# Altium schematic sheet MIXR Processing - STM32 DSP Microcontroller.SchDoc: STM32F767 DSP Microcontroller - GPIOs
size B; DocumentNumber: 9; SheetNumber: 9; SheetTotal: 14
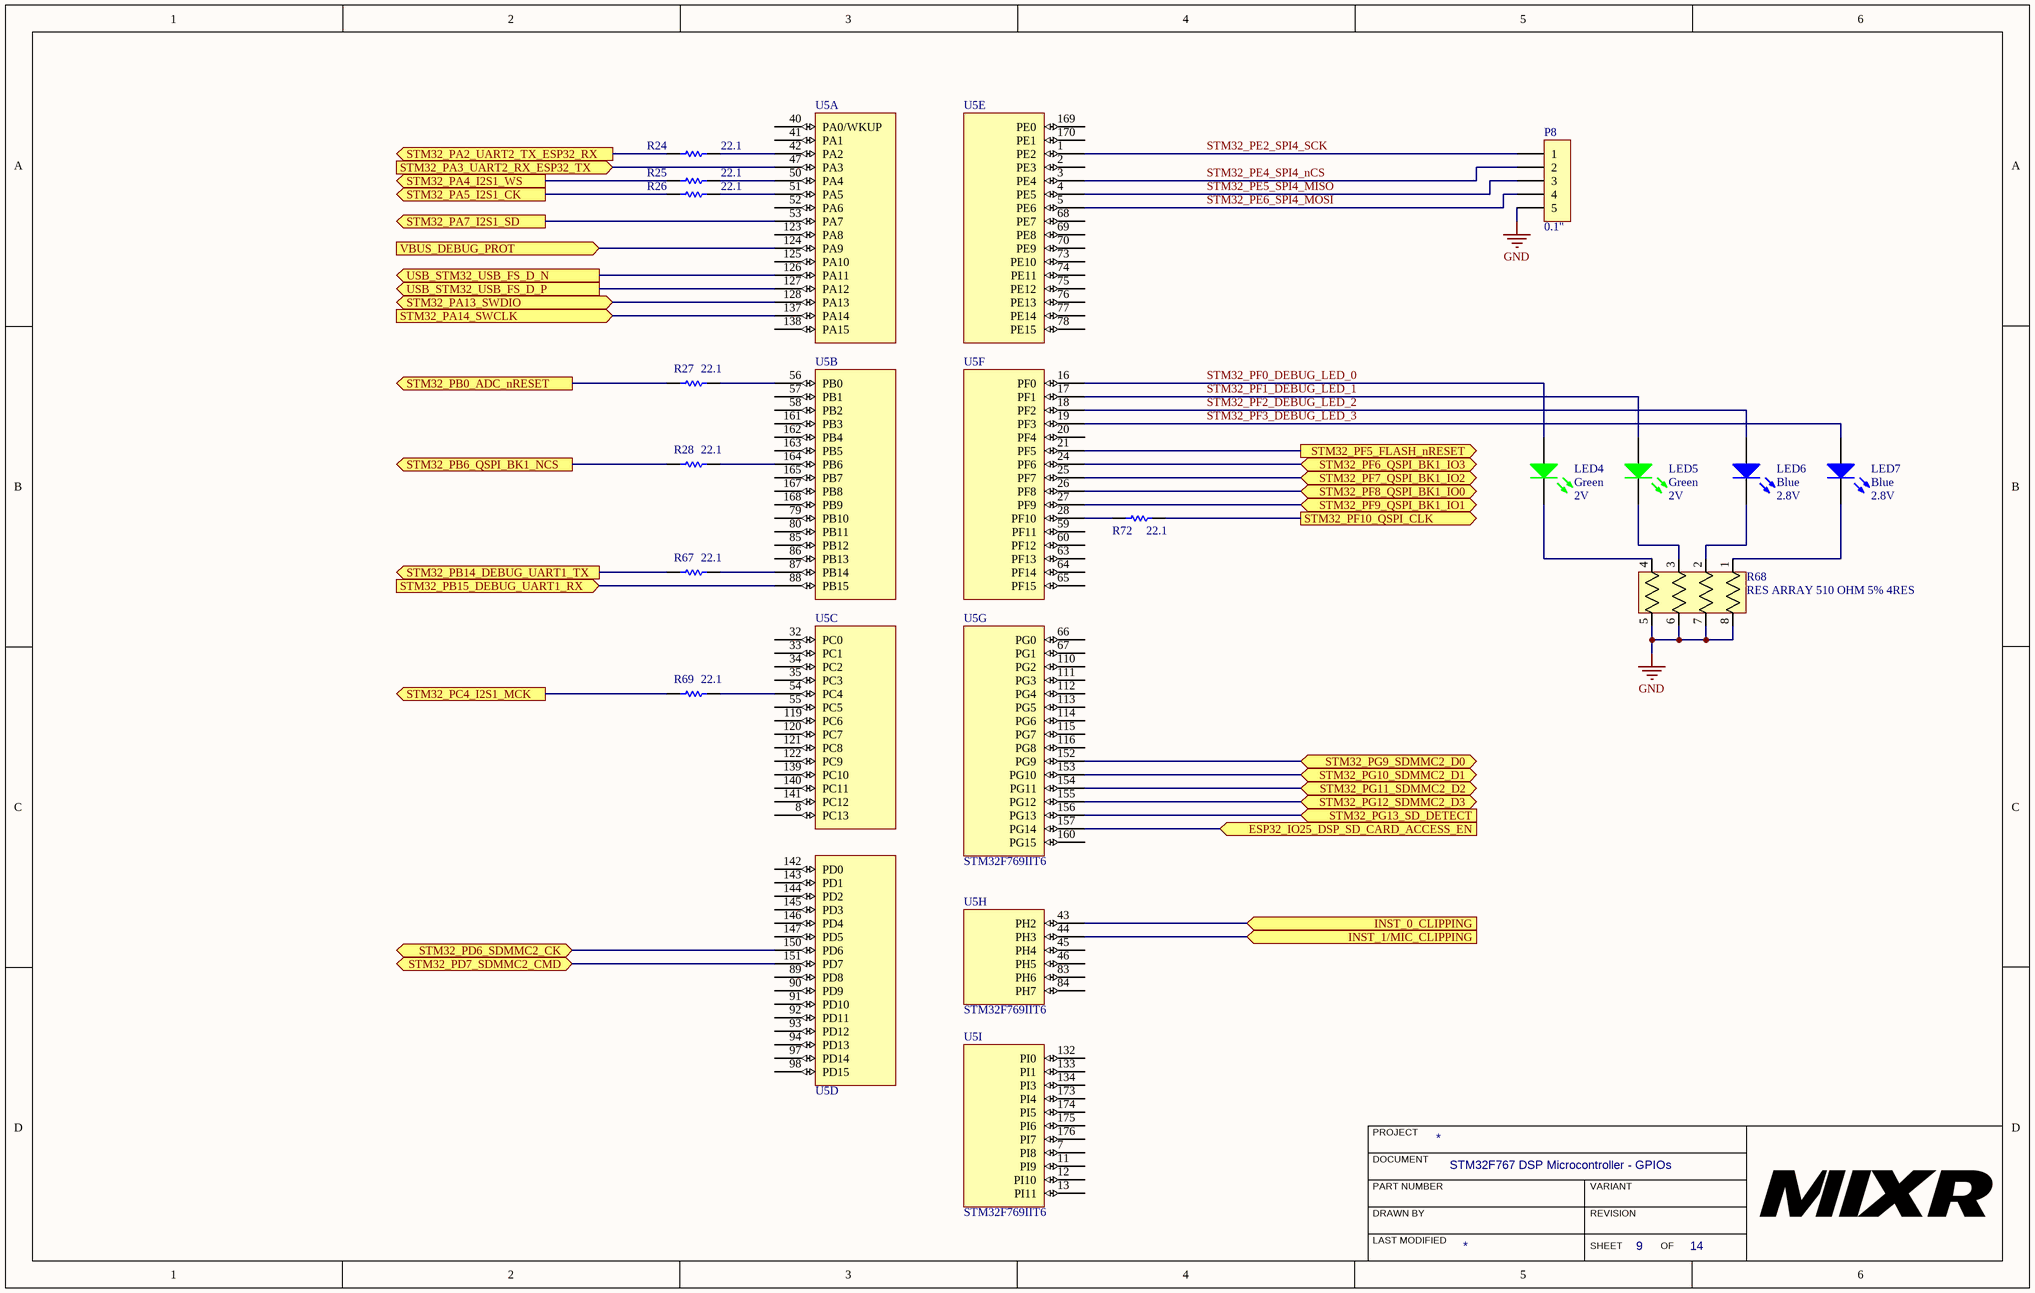
[diagram p0: MIXR Processing - STM32 DSP Microcontroller.SchDoc]

## Parts
LED4  Color: Green  Voltage - Forward (Vf) (Typ): 2V  [LED_0603]  (hidden comment: LED GREEN CLEAR 2V 0603)
LED5  Color: Green  Voltage - Forward (Vf) (Typ): 2V  [LED_0603]  (hidden comment: LED GREEN CLEAR 2V 0603)
LED6  Color: Blue  Voltage - Forward (Vf) (Typ): 2.8V  [LED_0603]  (hidden comment: LED BLUE CLEAR 2.8V 0603)
LED7  Color: Blue  Voltage - Forward (Vf) (Typ): 2.8V  [LED_0603]  (hidden comment: LED BLUE CLEAR 2.8V 0603)
P8  0.1"  [CONN, 5POS 1.23" 0.100" MALE Header]
R24  Resistance: 22.1  [RES, 0603]  (hidden comment: RES 22.1 OHM 1% 1/10W 0603)
R25  Resistance: 22.1  [RES, 0603]  (hidden comment: RES 22.1 OHM 1% 1/10W 0603)
R26  Resistance: 22.1  [RES, 0603]  (hidden comment: RES 22.1 OHM 1% 1/10W 0603)
R27  Resistance: 22.1  [RES, 0603]  (hidden comment: RES 22.1 OHM 1% 1/10W 0603)
R28  Resistance: 22.1  [RES, 0603]  (hidden comment: RES 22.1 OHM 1% 1/10W 0603)
R67  Resistance: 22.1  [RES, 0603]  (hidden comment: RES 22.1 OHM 1% 1/10W 0603)
R68  RES ARRAY 510 OHM 5% 4RES  [RES ARRAY 4 POS 0804]
R69  Resistance: 22.1  [RES, 0603]  (hidden comment: RES 22.1 OHM 1% 1/10W 0603)
R72  Resistance: 22.1  [RES, 0603]  (hidden comment: RES 22.1 OHM 1% 1/10W 0603)
U5  IC MCU STM32F769II 176-LQFP  [TSQFP50P2600X2600X160-176M]  (value not drawn)  (parts A,B,C,D,E,F,G,H,I of 11)

## Ports
ESP32_IO25_DSP_SD_CARD_ACCESS_EN (in), INST_0_CLIPPING (in), INST_1/MIC_CLIPPING (in), STM32_PA2_UART2_TX_ESP32_RX (out), STM32_PA3_UART2_RX_ESP32_TX (in), STM32_PA4_I2S1_WS (out), STM32_PA5_I2S1_CK (out), STM32_PA7_I2S1_SD (out), STM32_PA13_SWDIO (bidir), STM32_PA14_SWCLK (in), STM32_PB0_ADC_nRESET (out), STM32_PB6_QSPI_BK1_NCS (out), STM32_PB14_DEBUG_UART1_TX (out), STM32_PB15_DEBUG_UART1_RX (in), STM32_PC4_I2S1_MCK (out), STM32_PD6_SDMMC2_CK (bidir), STM32_PD7_SDMMC2_CMD (bidir), STM32_PF5_FLASH_nRESET (out), STM32_PF6_QSPI_BK1_IO3 (bidir), STM32_PF7_QSPI_BK1_IO2 (bidir), STM32_PF8_QSPI_BK1_IO0 (bidir), STM32_PF9_QSPI_BK1_IO1 (bidir), STM32_PF10_QSPI_CLK (out), STM32_PG9_SDMMC2_D0 (bidir), STM32_PG10_SDMMC2_D1 (bidir), STM32_PG11_SDMMC2_D2 (bidir), STM32_PG12_SDMMC2_D3 (bidir), STM32_PG13_SD_DETECT (in), USB_STM32_USB_FS_D_N (out), USB_STM32_USB_FS_D_P (out), VBUS_DEBUG_PROT (in)

## Nets
GND: P8.5 R68.5 R68.6 R68.7 R68.8
ESP32_IO25_DSP_SD_CARD_ACCESS_EN: U5.157(PG14) ; port ESP32_IO25_DSP_SD_CARD_ACCESS_EN
INST_0_CLIPPING: U5.43(PH2) ; port INST_0_CLIPPING
INST_1/MIC_CLIPPING: U5.44(PH3) ; port INST_1/MIC_CLIPPING
STM32_PA2_UART2_TX_ESP32_RX: R24.1 ; port STM32_PA2_UART2_TX_ESP32_RX
STM32_PA3_UART2_RX_ESP32_TX: U5.47(PA3) ; port STM32_PA3_UART2_RX_ESP32_TX
STM32_PA4_I2S1_WS: R25.1 ; port STM32_PA4_I2S1_WS
STM32_PA5_I2S1_CK: R26.1 ; port STM32_PA5_I2S1_CK
STM32_PA7_I2S1_SD: U5.53(PA7) ; port STM32_PA7_I2S1_SD
STM32_PA13_SWDIO: U5.128(PA13) ; port STM32_PA13_SWDIO
STM32_PA14_SWCLK: U5.137(PA14) ; port STM32_PA14_SWCLK
STM32_PB0_ADC_nRESET: R27.1 ; port STM32_PB0_ADC_nRESET
STM32_PB6_QSPI_BK1_NCS: R28.1 ; port STM32_PB6_QSPI_BK1_NCS
STM32_PB14_DEBUG_UART1_TX: R67.1 ; port STM32_PB14_DEBUG_UART1_TX
STM32_PB15_DEBUG_UART1_RX: U5.88(PB15) ; port STM32_PB15_DEBUG_UART1_RX
STM32_PC4_I2S1_MCK: R69.1 ; port STM32_PC4_I2S1_MCK
STM32_PD6_SDMMC2_CK: U5.150(PD6) ; port STM32_PD6_SDMMC2_CK
STM32_PD7_SDMMC2_CMD: U5.151(PD7) ; port STM32_PD7_SDMMC2_CMD
STM32_PE2_SPI4_SCK: P8.1 U5.1(PE2)
STM32_PE4_SPI4_nCS: P8.2 U5.3(PE4)
STM32_PE5_SPI4_MISO: P8.3 U5.4(PE5)
STM32_PE6_SPI4_MOSI: P8.4 U5.5(PE6)
STM32_PF0_DEBUG_LED_0: LED4.1(A) U5.16(PF0)
STM32_PF1_DEBUG_LED_1: LED5.1(A) U5.17(PF1)
STM32_PF2_DEBUG_LED_2: LED6.1(A) U5.18(PF2)
STM32_PF3_DEBUG_LED_3: LED7.1(A) U5.19(PF3)
STM32_PF5_FLASH_nRESET: U5.21(PF5) ; port STM32_PF5_FLASH_nRESET
STM32_PF6_QSPI_BK1_IO3: U5.24(PF6) ; port STM32_PF6_QSPI_BK1_IO3
STM32_PF7_QSPI_BK1_IO2: U5.25(PF7) ; port STM32_PF7_QSPI_BK1_IO2
STM32_PF8_QSPI_BK1_IO0: U5.26(PF8) ; port STM32_PF8_QSPI_BK1_IO0
STM32_PF9_QSPI_BK1_IO1: U5.27(PF9) ; port STM32_PF9_QSPI_BK1_IO1
STM32_PF10_QSPI_CLK: R72.2 ; port STM32_PF10_QSPI_CLK
STM32_PG9_SDMMC2_D0: U5.152(PG9) ; port STM32_PG9_SDMMC2_D0
STM32_PG10_SDMMC2_D1: U5.153(PG10) ; port STM32_PG10_SDMMC2_D1
STM32_PG11_SDMMC2_D2: U5.154(PG11) ; port STM32_PG11_SDMMC2_D2
STM32_PG12_SDMMC2_D3: U5.155(PG12) ; port STM32_PG12_SDMMC2_D3
STM32_PG13_SD_DETECT: U5.156(PG13) ; port STM32_PG13_SD_DETECT
USB_STM32_USB_FS_D_N: U5.126(PA11) ; port USB_STM32_USB_FS_D_N
USB_STM32_USB_FS_D_P: U5.127(PA12) ; port USB_STM32_USB_FS_D_P
VBUS_DEBUG_PROT: U5.124(PA9) ; port VBUS_DEBUG_PROT
NetLED4_2: LED4.2(K) R68.4
NetLED5_2: LED5.2(K) R68.3
NetLED6_2: LED6.2(K) R68.2
NetLED7_2: LED7.2(K) R68.1
NetR24_2: R24.2 U5.42(PA2)
NetR25_2: R25.2 U5.50(PA4)
NetR26_2: R26.2 U5.51(PA5)
NetR27_2: R27.2 U5.56(PB0)
NetR28_2: R28.2 U5.164(PB6)
NetR67_2: R67.2 U5.87(PB14)
NetR69_2: R69.2 U5.54(PC4)
NetR72_1: R72.1 U5.28(PF10)

Not connected (* = marked no-connect by the designer): U5 2(PE3) 7(PI8) 8(PC13) 11(PI9) 12(PI10) 13(PI11) 20(PF4) 32(PC0) 33(PC1) 34(PC2) 35(PC3) 40(PA0/WKUP) 41(PA1) 45(PH4) 46(PH5) 52(PA6) 55(PC5) 57(PB1) 58(PB2) 59(PF11) 60(PF12) 63(PF13) 64(PF14) 65(PF15) 66(PG0) 67(PG1) 68(PE7) 69(PE8) 70(PE9) 73(PE10) 74(PE11) 75(PE12) 76(PE13) 77(PE14) 78(PE15) 79(PB10) 80(PB11) 83(PH6) 84(PH7) 85(PB12) 86(PB13) 89(PD8) 90(PD9) 91(PD10) 92(PD11) 93(PD12) 94(PD13) 97(PD14) 98(PD15) 110(PG2) 111(PG3) 112(PG4) 113(PG5) 114(PG6) 115(PG7) 116(PG8) 119(PC6) 120(PC7) 121(PC8) 122(PC9) 123(PA8) 125(PA10) 132(PI0) 133(PI1) 134(PI3) 138(PA15) 139(PC10) 140(PC11) 141(PC12) 142(PD0) 143(PD1) 144(PD2) 145(PD3) 146(PD4) 147(PD5) 160(PG15) 161(PB3) 162(PB4) 163(PB5) 165(PB7) 167(PB8) 168(PB9) 169(PE0) 170(PE1) 173(PI4) 174(PI5) 175(PI6) 176(PI7)

## Notes on the sheet
- PROJECT
- DOCUMENT
- DRAWN BY
- LAST MODIFIED
- PART NUMBER
- REVISION
- SHEET
- VARIANT
- OF

## Library data of the parts
LED4 LED5 = LED GREEN CLEAR 2V 0603: Green 572nm LED Indication - Discrete 2V 0603 (1608 Metric); Manufacturer: Wurth Electronics Inc.; Manufacturer Part Number: 150060VS75000; Lens Color: Colorless; Millicandela Rating: 40mcd; Lens Style/Size: Rectangle with Flat Top, 1.10mm x 0.70mm; Current - Test: 20mA; Viewing Angle: 140°; Wavelength - Dominant: 570nm; Supplier 1: Digi-Key; RoHS: RoHS Compliant; Category: Optoelectronics; Stock 1: 9408; Pricing 1: 1=0.21, 100=0.1617, 500=0.13964 (CAD); Packaging: Cut Tape (CT); Part Status: Active; Lens Transparency: Clear; Mounting Type: Surface Mount; Wavelength - Peak: 572nm; Features: -; Package / Case: 0603 (1608 Metric); Supplier Device Package: 0603; Size / Dimension: 1.60mm L x 0.80mm W; Height (Max): 0.80mm; ComponentLink1URL: http://katalog.we-online.de/led/datasheet/150060VS75000.pdf; ComponentLink1Description: http://katalog.we-online.de/led/datasheet/150060VS75000.pdf; Supplier Part Number 1: 732-4980-1-ND
LED6 LED7 = LED BLUE CLEAR 2.8V 0603: Blue 470nm LED Indication - Discrete 2.8V 0603 (1608 Metric); Manufacturer 1: Lite-On Inc.; Manufacturer Part Number 1: LTST-C193TBKT-5A; Lens Color: Colorless; Millicandela Rating: 15mcd; Lens Style/Size: Rectangle with Flat Top, 1.15mm x 0.80mm; Current - Test: 5mA; Viewing Angle: 130°; Wavelength - Peak: 468nm; Supplier 1: Digi-Key; Supplier Part Number 1: 160-1827-1-ND; Packaging: Cut Tape (CT); Part Status: Active; Lens Transparency: Clear; Mounting Type: Surface Mount; Wavelength - Dominant: 470nm; Package / Case: 0603 (1608 Metric); Supplier Device Package: Chip LED; Size / Dimension: 1.60mm L x 0.80mm W; Height (Max): 0.45mm; ComponentLink1URL: http://optoelectronics.liteon.com/upload/download/DS22-2004-060/P_100_LTST-C193TBKT-5A.pdf; ComponentLink1Description: http://optoelectronics.liteon.com/upload/download/DS22-2004-060/P_100_LTST-C193TBKT-5A.pdf
P8 = CONN 5POS 0.1" 1" MALE HEADER: CONN HEADER 5POS .100" SNGL; Manufacturer: Samtec; Manufacturer Part Number: TSW-105-20-T-S; Number of Positions: 5; Gender: Male; Connector Type: Male Pin; Pitch: 0.1inch; RoHS: Yes; Category: Headers and Wire Housings; Stock 1: 939; Pricing 1: 1=0.45000, 10=0.42300, 100=0.32430, 500=0.28200, 1000=0.23265, 5000=0.20445, 10000=0.19035 (USD); Mount: Through Hole; Color: Black; Contact Plating: Tin; Contact Material: Bronze; Package Quantity: 1; Number of Rows: 1; Packaging: Rail/Tube; Termination: Solder; Number of Contacts: 5; Contact Mating Length: 1.02inch; Radiation Hardening: No; REACH SVHC: No SVHC; Lead Free: Lead Free; ComponentLink1URL: https://datasheet.ciiva.com/739/tsw-xxx-xx-xxx-x-xx-xxx-mkt-739939.pdf?src-supplier=Digi-Key; ComponentLink1Description: https://datasheet.ciiva.com/739/tsw-xxx-xx-xxx-x-xx-xxx-mkt-739939.pdf?src-supplier=Digi-Key; ComponentLink2URL: https://datasheet.ciiva.com/29947/htsw-th-29947990.pdf?src-supplier=Avnet; ComponentLink2Description: https://datasheet.ciiva.com/29947/htsw-th-29947990.pdf?src-supplier=Avnet; Supplier 1: Digi-Key; Supplier Part Number 1: SAM9000-ND
R24-R28 R67 R69 R72 = RES 22.1 OHM 1% 1/10W 0603: 22.1 Ohm ±1% 0.1W, 1/10W Chip Resistor 0603 (1608 Metric) Moisture Resistant Thick Film; Manufacturer 1: Yageo; Manufacturer Part Number 1: RC0603FR-0722R1L; Temperature Coefficient: ±100ppm/°C; Supplier 1: Digi-Key; Supplier Part Number 1: 311-22.1HRCT-ND; Packaging: Cut Tape (CT); Composition: Thick Film; ComponentLink1URL: http://www.yageo.com/documents/recent/PYu-RC_Group_51_RoHS_L_7.pdf; ComponentLink1Description: http://www.yageo.com/documents/recent/PYu-RC_Group_51_RoHS_L_7.pdf; Tolerance: ±1%; Part Status: Active; Operating Temperature: -55°C ~ 155°C; Package / Case: 0603 (1608 Metric); Supplier Device Package: 0603; Size / Dimension: 0.063" L x 0.031" W (1.60mm x 0.80mm); Height - Seated (Max): 0.022" (0.55mm); Failure Rate: -; Power: 1/10W
R68 = RES ARRAY 510 OHM 5% 4RES EXB-N8V511JX: RES ARRAY SMD 510 OHM 5% 4RES EXB-N8V511JX; Manufacturer: Panasonic Electronic Components; Circuit Type: Isolated; Resistance (Ohms): 510; Power Per Element: 31mW; Temperature Coefficient: ±200ppm/°C; Supplier 1: Digi-Key; Manufacturer Part Number: EXB-N8V511JX; RoHS: RoHS Compliant; Category: Resistors; Stock 1: 25621; Packaging: Cut Tape (CT); Part Status: Active; Tolerance: ±5%; Operating Temperature: -55°C ~ 125°C; Applications: -; Mounting Type: Surface Mount; Package / Case: 0804, Concave, Long Side Terminals; Supplier Device Package: 0804; Size / Dimension: 0.079" L x 0.039" W (2.00mm x 1.00mm); Height - Seated (Max): 0.022" (0.55mm); ComponentLink1URL: https://industrial.panasonic.com/cdbs/www-data/pdf/AOC0000/AOC0000C14.pdf; ComponentLink1Description: https://industrial.panasonic.com/cdbs/www-data/pdf/AOC0000/AOC0000C14.pdf; Supplier Part Number 1: Y10511CT-ND; Pricing 1: 1=0.15, 10=0.101, 25=0.0696, 50=0.0544, 100=0.0389, 250=0.03024, 500=0.02404, 1000=0.01706, 5000=0.01319 (CAD)
U5 = IC MCU STM32F769II 176-LQFP: ARM® Cortex®-M7 STM32F7 Microcontroller IC 32-Bit 216MHz 2MB (2M x 8) FLASH 176-LQFP (24x24); Manufacturer: STMicroelectronics; Manufacturer Part Number: STM32F769IIT6; Supplier 1: Digi-Key; RoHS: No; Category: Microcontrollers; Stock 1: 295; Pricing 1: 1=12.69000, 10=11.66300, 25=11.18000, 100=9.85040, 250=9.36696, 500=8.76264, 1000=8.03746 (USD); ComponentLink1URL: http://www.st.com/content/ccc/resource/technical/document/errata_sheet/group0/23/a6/11/0b/30/24/46/a5/DM00257543/files/DM00257543.pdf/jcr:content/translations/en.DM00257543.pdf?src-supplier=Digi-Key; ComponentLink1Description: http://www.st.com/content/ccc/resource/technical/document/errata_sheet/group0/23/a6/11/0b/30/24/46/a5/DM00257543/files/DM00257543.pdf/jcr:content/translations/en.DM00257543.pdf?src-supplier=Digi-Key; Supplier Part Number 1: 497-16649-ND